# EAGLE schematic BITalino_V3 (EAGLE 6.3)
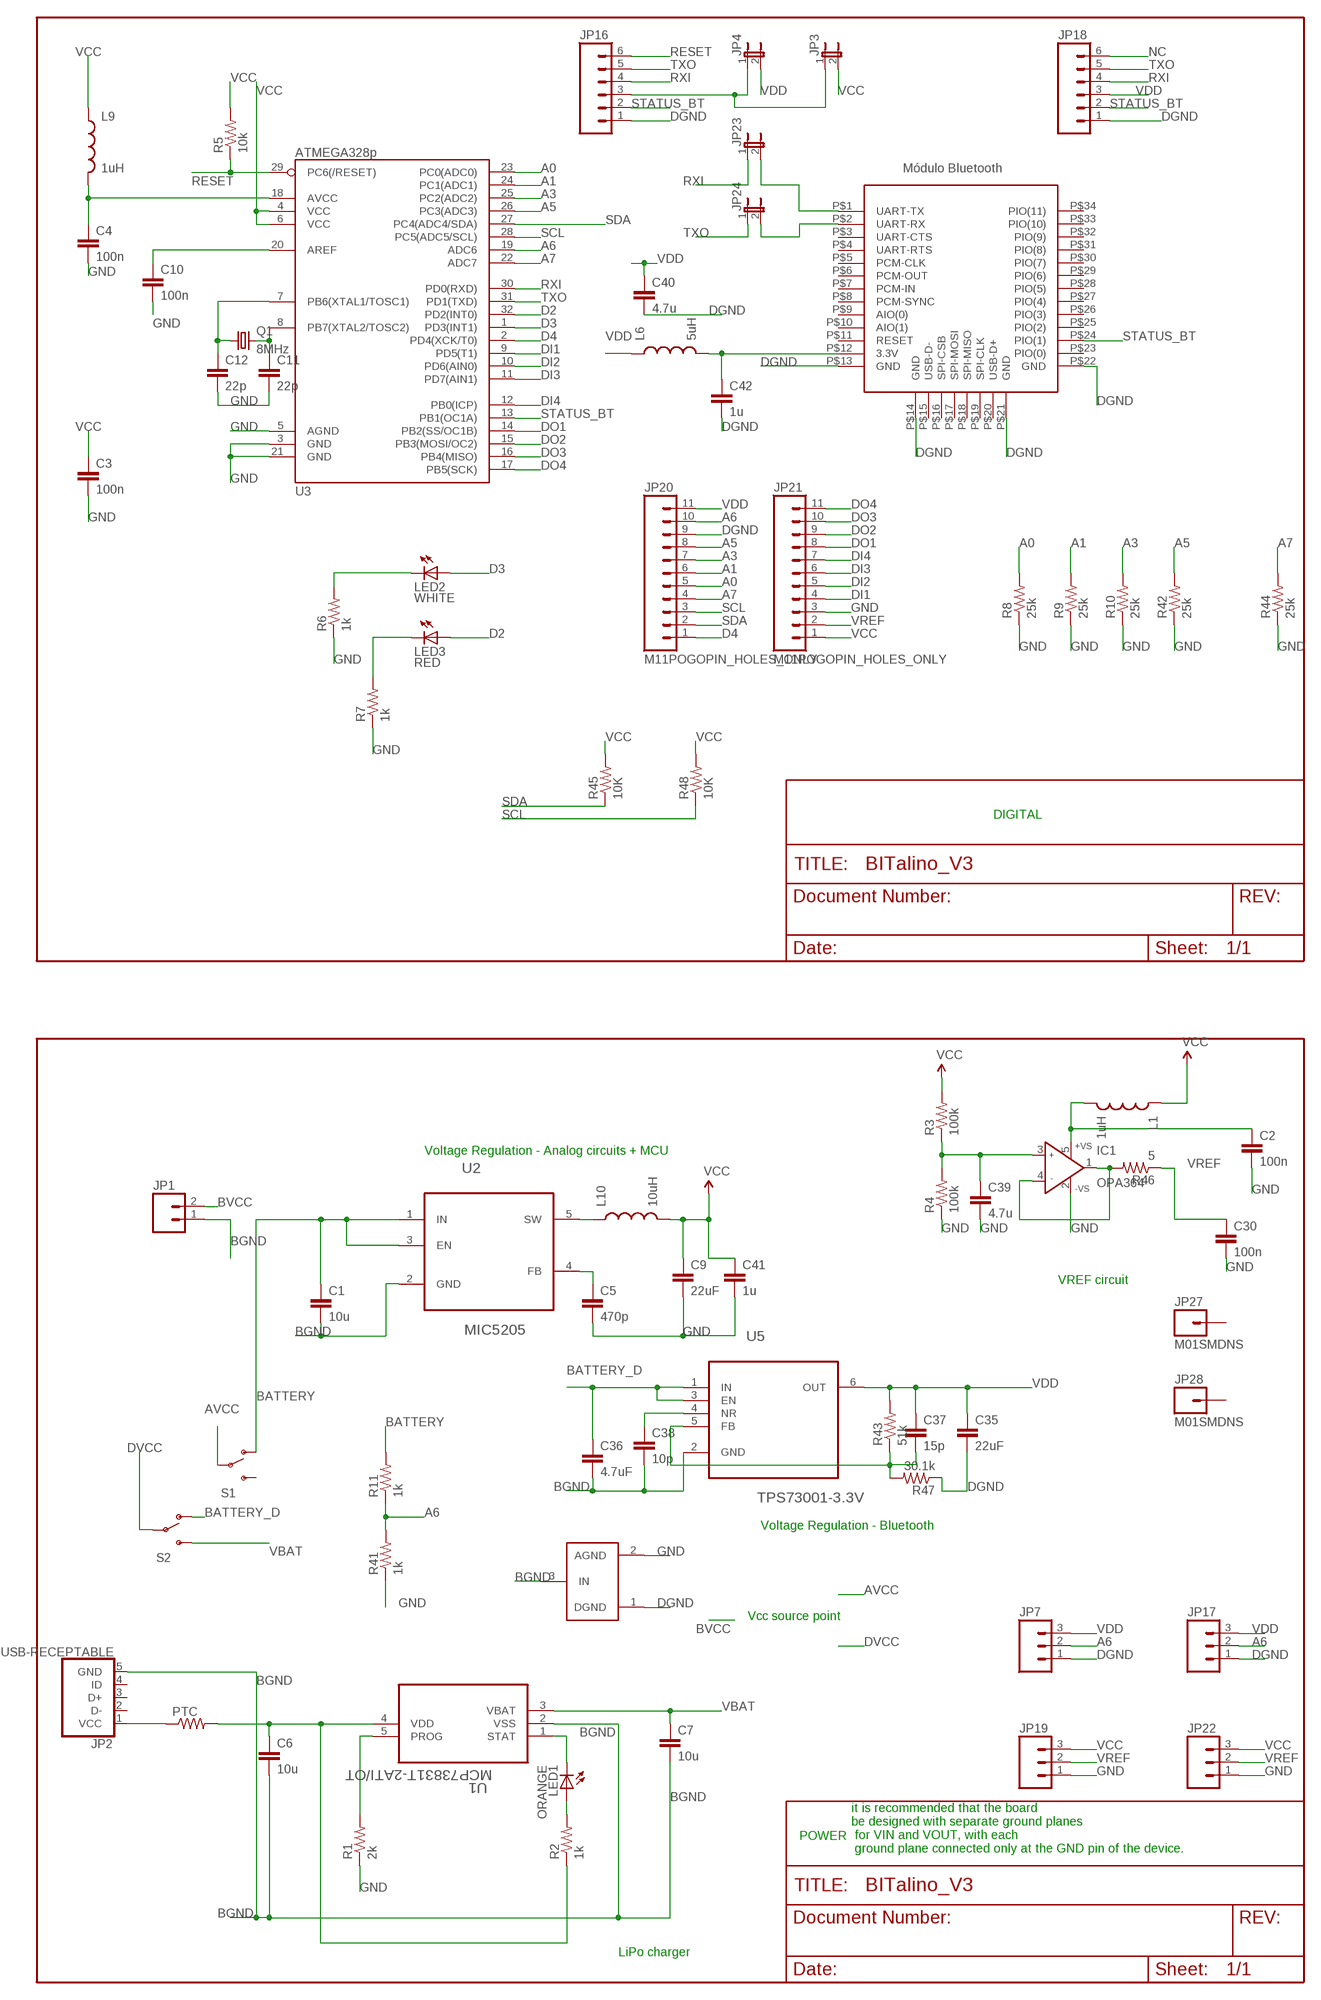
[diagram p0: schematic, sheet 1, part 1 of 3]
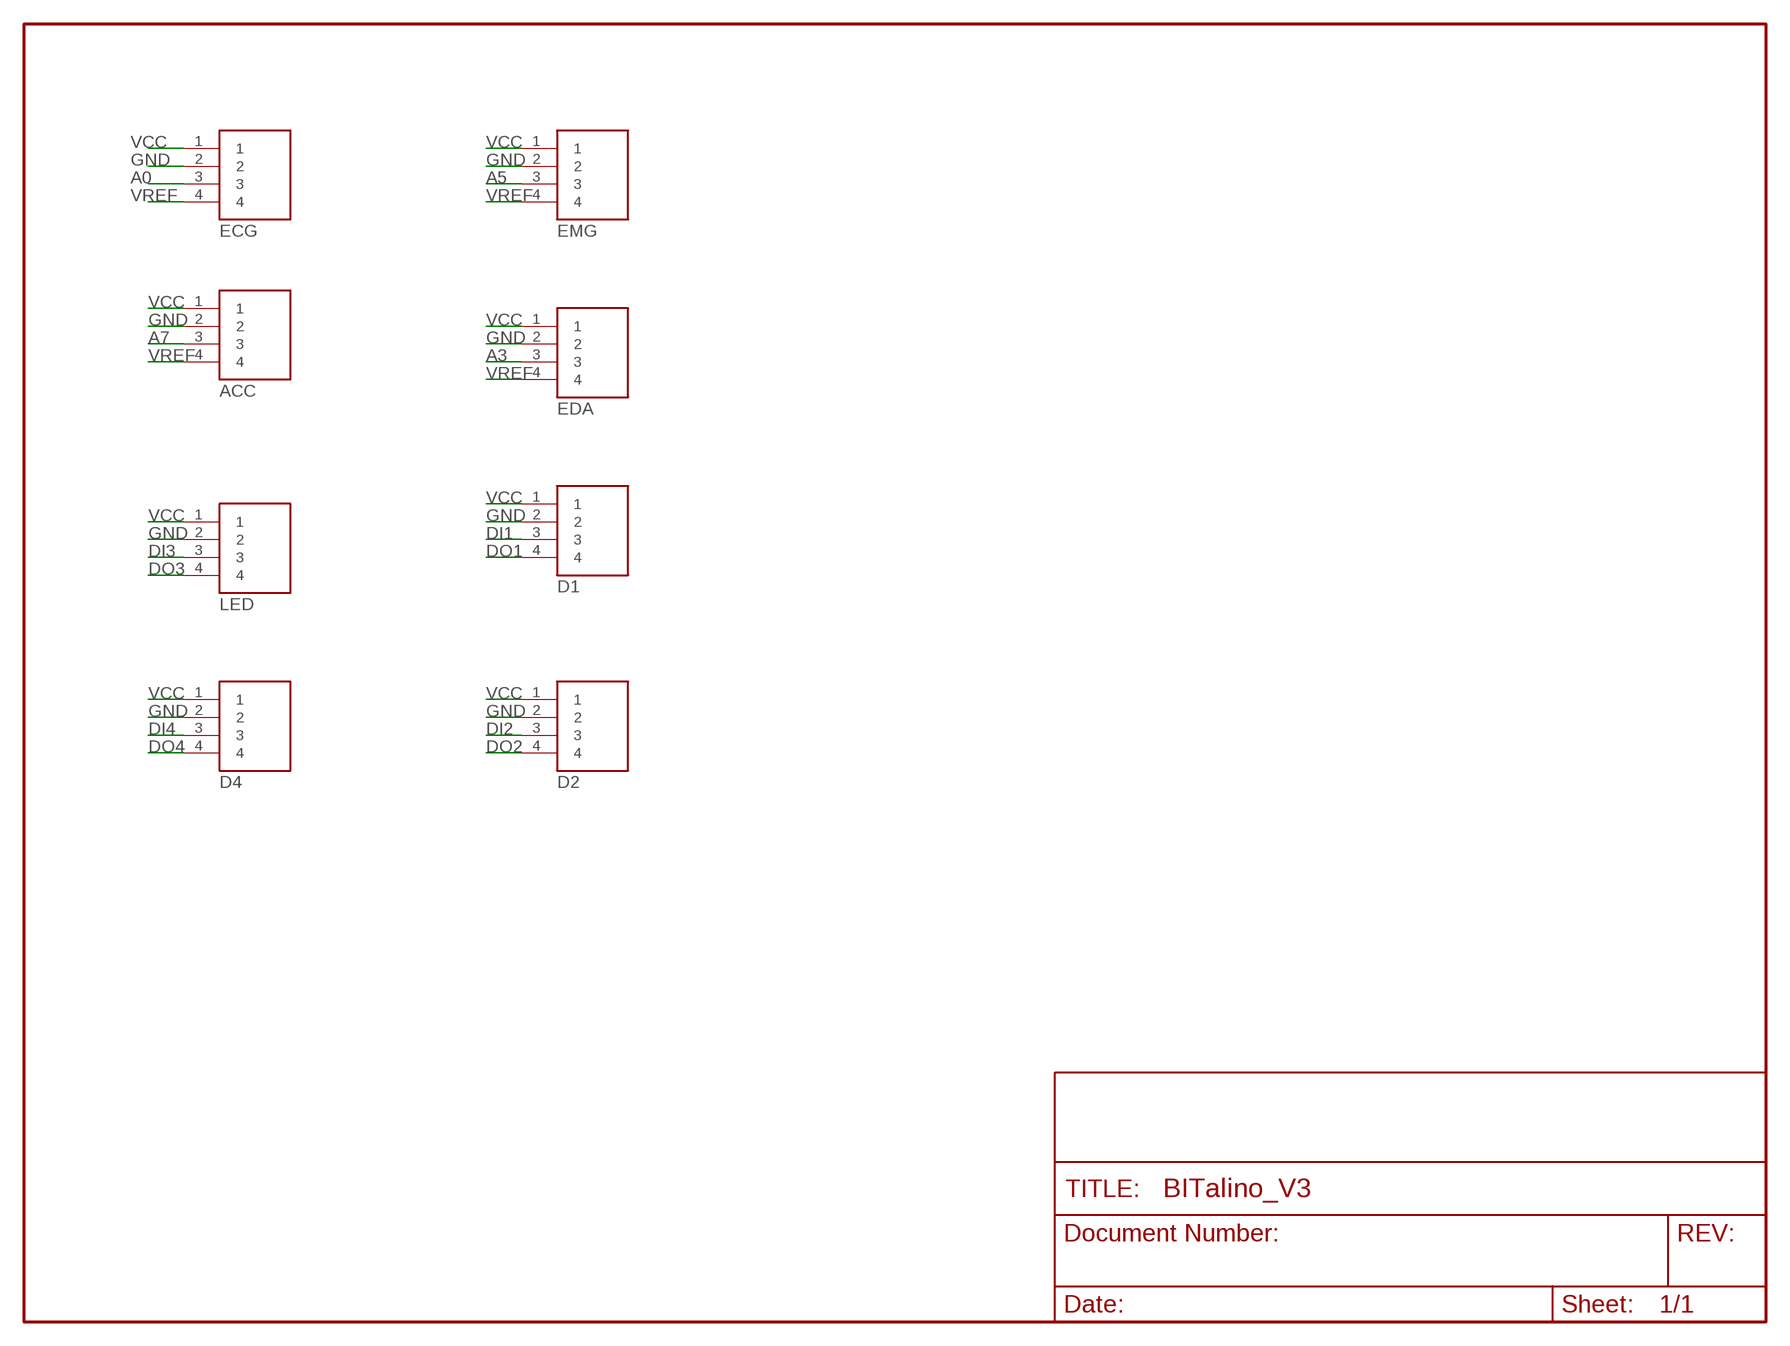
[diagram p1: schematic, sheet 1, part 2 of 3]
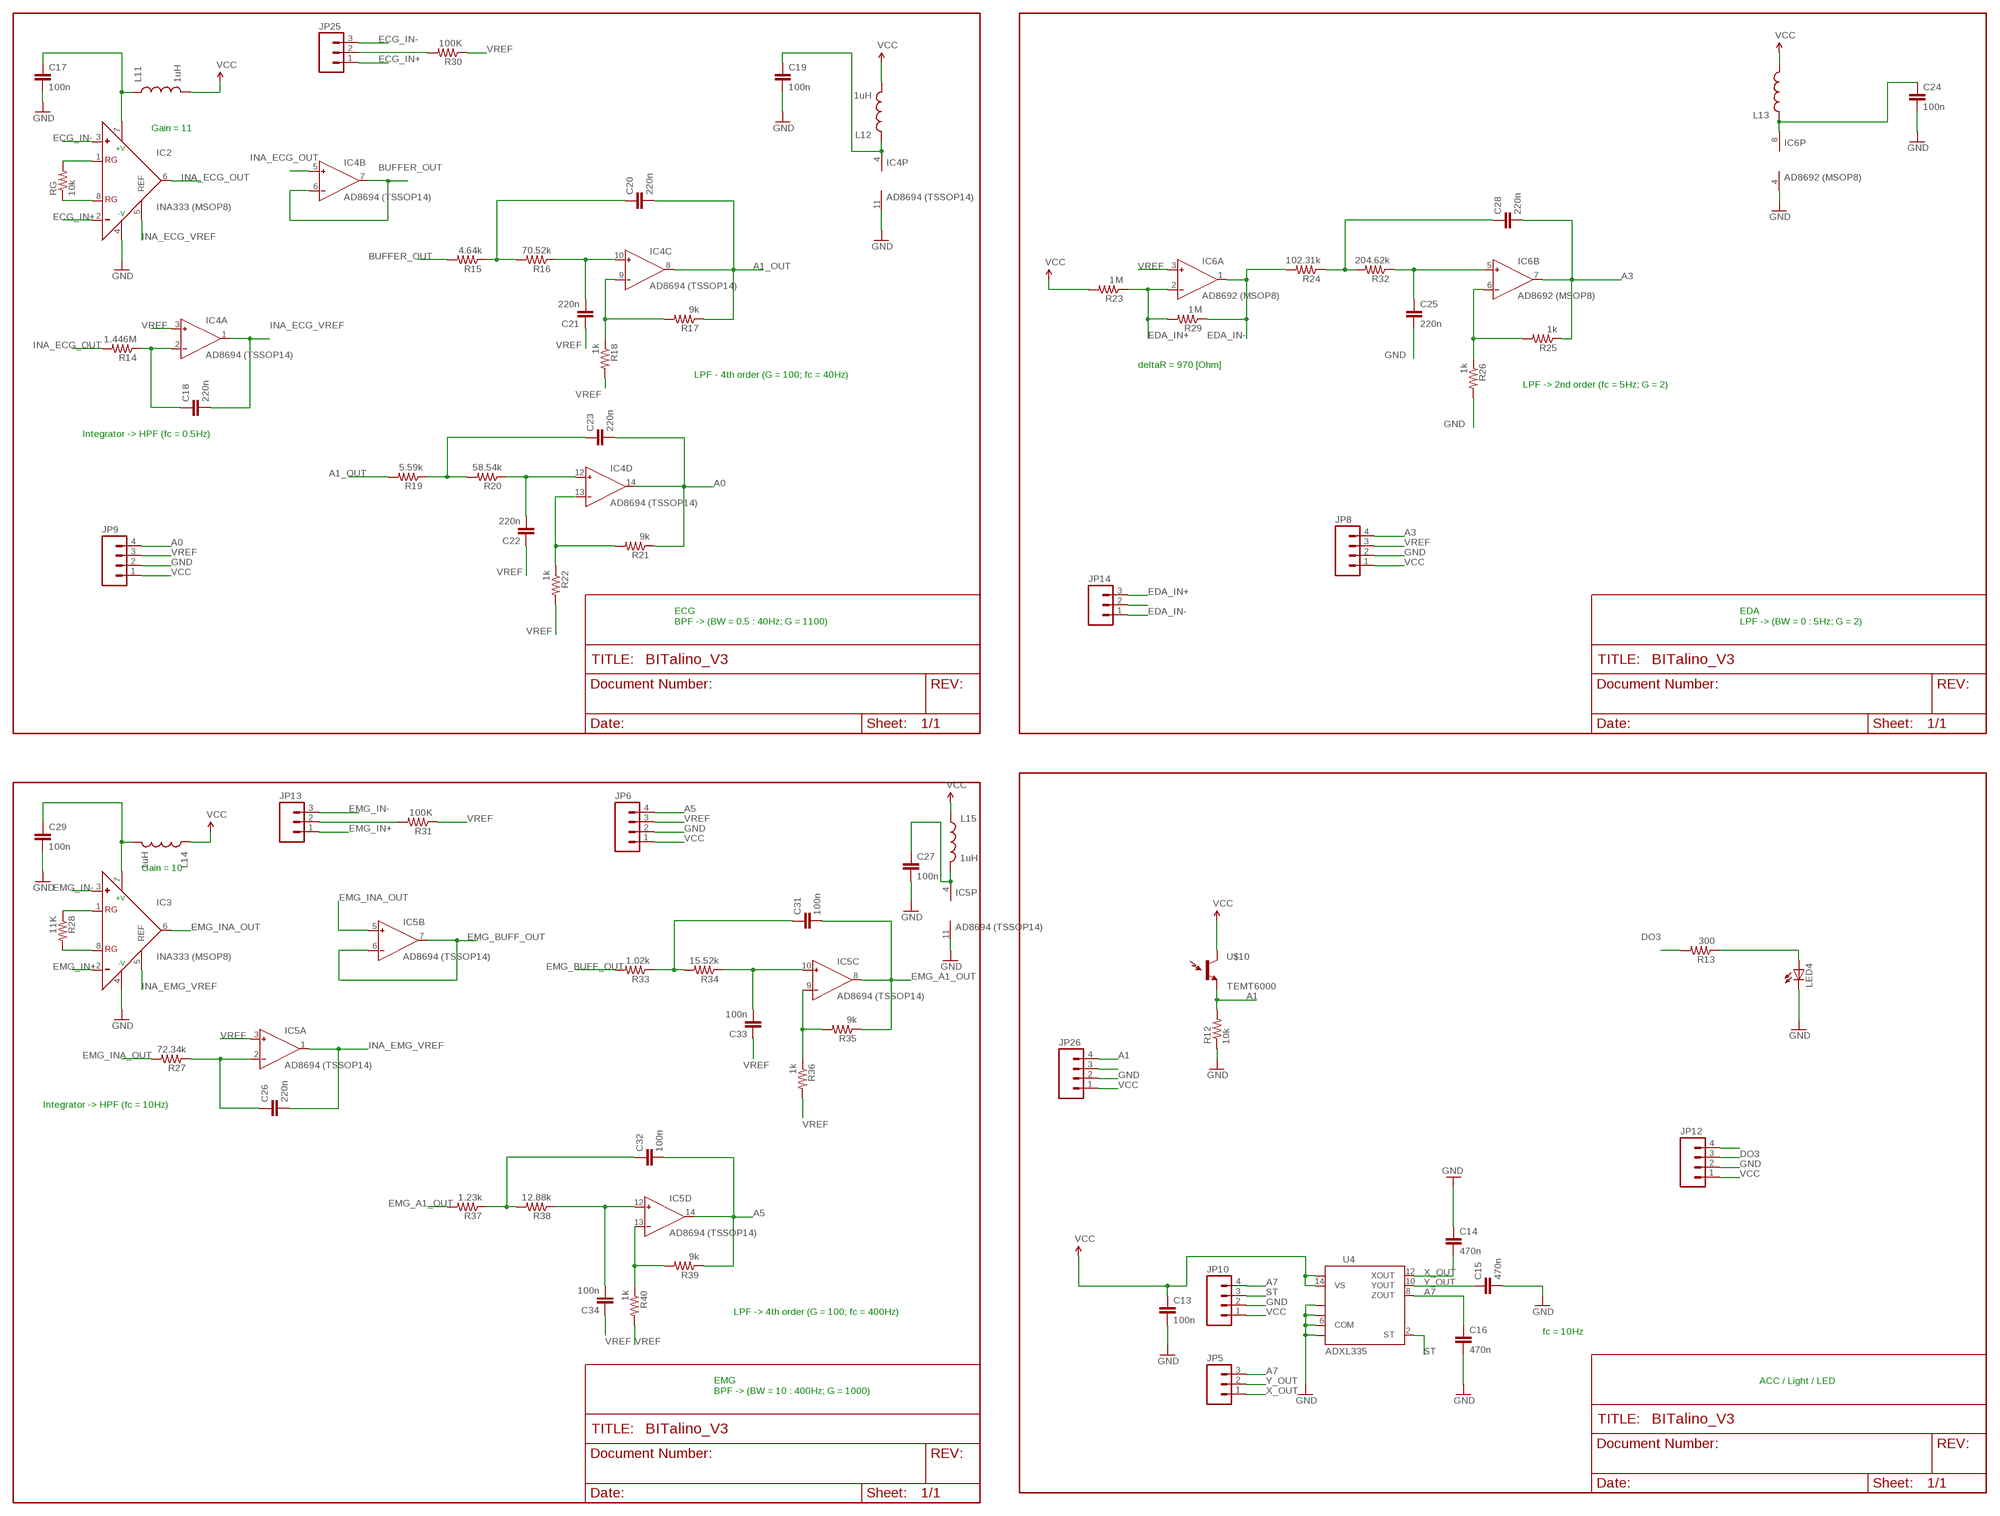
[diagram p2: schematic, sheet 1, part 3 of 3]

## Parts
ACC  RJ22  [SMD]
C1  10u  CAP0805  [0805]
C2  100n  CAP0603-CAP  [0603-CAP]
C3  100n  CAP0603-CAP  [0603-CAP]
C4  100n  CAP0603-CAP  [0603-CAP]
C5  470p  CAP0603-CAP  [0603-CAP]
C6  10u  CAP0805  [0805]
C7  10u  CAP0805  [0805]
C9  22uF  CAP0805  [0805]
C10  100n  CAP0603-CAP  [0603-CAP]
C11  22p  CAP0603-CAP  [0603-CAP]
C12  22p  CAP0603-CAP  [0603-CAP]
C13  100n  CAP0603-CAP  [0603-CAP]
C14  470n  CAP0603-CAP  [0603-CAP]
C15  470n  CAP0603-CAP  [0603-CAP]
C16  470n  CAP0603-CAP  [0603-CAP]
C17  100n  CAP0603-CAP  [0603-CAP]
C18  220n  CAP0603-CAP  [0603-CAP]
C19  100n  CAP0603-CAP  [0603-CAP]
C20  220n  CAP0603-CAP  [0603-CAP]
C21  220n  CAP0603-CAP  [0603-CAP]
C22  220n  CAP0603-CAP  [0603-CAP]
C23  220n  CAP0603-CAP  [0603-CAP]
C24  100n  CAP0603-CAP  [0603-CAP]
C25  220n  CAP0603-CAP  [0603-CAP]
C26  220n  CAP0603-CAP  [0603-CAP]
C27  100n  CAP0603-CAP  [0603-CAP]
C28  220n  CAP0603-CAP  [0603-CAP]
C29  100n  CAP0603-CAP  [0603-CAP]
C30  100n  CAP0603-CAP  [0603-CAP]
C31  100n  CAP0603-CAP  [0603-CAP]
C32  100n  CAP0603-CAP  [0603-CAP]
C33  100n  CAP0603-CAP  [0603-CAP]
C34  100n  CAP0603-CAP  [0603-CAP]
C35  22uF  CAP0805  [0805]
C36  4.7uF  CAP0805  [0805]
C37  15p  CAP0603-CAP  [0603-CAP]
C38  10p  CAP0603-CAP  [0603-CAP]
C39  4.7u  CAP0603-CAP  [0603-CAP]
C40  4.7u  CAP0603-CAP  [0603-CAP]
C41  1u  CAP0603-CAP  [0603-CAP]
C42  1u  CAP0603-CAP  [0603-CAP]
D1  RJ22  [SMD]
D2  RJ22  [SMD]
D4  RJ22  [SMD]
ECG  RJ22  [SMD]
EDA  RJ22  [SMD]
EMG  ECG  RJ22  [SMD]
IC1  OPA364  AD8541RJ  [SOT23-5]
IC2  INA333 (MSOP8)  AD623RM  [MSOP08]
IC3  INA333 (MSOP8)  AD623RM  [MSOP08]
IC4  AD8694 (TSSOP14)  AD8644RU  [TSSOP14]
IC5  AD8694 (TSSOP14)  AD8644RU  [TSSOP14]
IC6  AD8692 (MSOP8)  AD8656RM  [MSOP08]
JP1  M02-JST-2-PTH-NO_SILK  [JST-2-PTH-NS]
JP2  USB-RECEPTABLE  [FCI-10103594-0001LF]
JP3  JUMPER-2SMD-NO-NS  [SJ_2S-NO-NS]
JP4  JUMPER-2SMD-NO-NS  [SJ_2S-NO-NS]
JP5  M03JST-PTH  [JST-3-PTH]
JP6  M04JST-PTH  [JST-4-PTH]
JP7  M031X03_NO_SILK  [1X03_NO_SILK]
JP8  M04JST-PTH  [JST-4-PTH]
JP9  M04JST-PTH  [JST-4-PTH]
JP10  M04JST-PTH  [JST-4-PTH]
JP12  M04JST-PTH  [JST-4-PTH]
JP13  M03JST-PTH  [JST-3-PTH]
JP14  M03JST-PTH  [JST-3-PTH]
JP16  M06POGOPIN_HOLES_ONLY  [1X06_HOLES_ONLY]
JP17  M031X03_NO_SILK  [1X03_NO_SILK]
JP18  M06POGOPIN_HOLES_ONLY  [1X06_HOLES_ONLY]
JP19  M031X03_NO_SILK  [1X03_NO_SILK]
JP20  M11POGOPIN_HOLES_ONLY  [1X11_HOLES_ONLY]
JP21  M11POGOPIN_HOLES_ONLY  [1X11_HOLES_ONLY]
JP22  M031X03_NO_SILK  [1X03_NO_SILK]
JP23  JUMPER-2SMD-NO-NS  [SJ_2S-NO-NS]
JP24  JUMPER-2SMD-NO-NS  [SJ_2S-NO-NS]
JP25  M03JST-PTH  [JST-3-PTH]
JP26  M04JST-PTH  [JST-4-PTH]
JP27  M01SMDNS  [1X01NS]
JP28  M01SMDNS  [1X01NS]
L1  1uH  INDUCTOR0603  [0603]
L6  5uH  INDUCTOR0805  [0805]
L9  1uH  INDUCTOR0603  [0603]
L10  10uH  INDUCTOR0805  [0805]
L11  1uH  INDUCTOR0603  [0603]
L12  1uH  INDUCTOR0603  [0603]
L13  INDUCTOR0603  [0603]
L14  1uH  INDUCTOR0603  [0603]
L15  1uH  INDUCTOR0603  [0603]
LED  RJ22  [SMD]
LED1  ORANGE  LED0603  [LED-0603]
LED2  WHITE  LED0603  [LED-0603]
LED3  RED  LED0603  [LED-0603]
LED4  LED1206  [LED-1206]
PTC  RESISTOR0805-RES  [0805]
Q1  8MHz  CRYSTALCTS406  [CTS406]
R1  2k  RESISTOR0603-RES  [0603-RES]
R2  1k  RESISTOR0603-RES  [0603-RES]
R3  100k  RESISTOR0603-RES  [0603-RES]
R4  100k  RESISTOR0603-RES  [0603-RES]
R5  10k  RESISTOR0603-RES  [0603-RES]
R6  1k  RESISTOR0603-RES  [0603-RES]
R7  1k  RESISTOR0603-RES  [0603-RES]
R8  25k  RESISTOR0603-RES  [0603-RES]
R9  25k  RESISTOR0603-RES  [0603-RES]
R10  25k  RESISTOR0603-RES  [0603-RES]
R11  1k  RESISTOR0603-RES  [0603-RES]
R12  10k  RESISTOR0603-RES  [0603-RES]
R13  300  RESISTOR0603-RES  [0603-RES]
R14  1.446M  RESISTOR0603-RES  [0603-RES]
R15  4.64k  RESISTOR0603-RES  [0603-RES]
R16  70.52k  RESISTOR0603-RES  [0603-RES]
R17  9k  RESISTOR0603-RES  [0603-RES]
R18  1k  RESISTOR0603-RES  [0603-RES]
R19  5.59k  RESISTOR0603-RES  [0603-RES]
R20  58.54k  RESISTOR0603-RES  [0603-RES]
R21  9k  RESISTOR0603-RES  [0603-RES]
R22  1k  RESISTOR0603-RES  [0603-RES]
R23  1M  RESISTOR0603-RES  [0603-RES]
R24  102.31k  RESISTOR0603-RES  [0603-RES]
R25  1k  RESISTOR0603-RES  [0603-RES]
R26  1k  RESISTOR0603-RES  [0603-RES]
R27  72.34k  RESISTOR0603-RES  [0603-RES]
R28  11K  RESISTOR0603-RES  [0603-RES]
R29  1M  RESISTOR0603-RES  [0603-RES]
R30  100K  RESISTOR0603-RES  [0603-RES]
R31  100K  RESISTOR0603-RES  [0603-RES]
R32  204.62k  RESISTOR0603-RES  [0603-RES]
R33  1.02k  RESISTOR0603-RES  [0603-RES]
R34  15.52k  RESISTOR0603-RES  [0603-RES]
R35  9k  RESISTOR0603-RES  [0603-RES]
R36  1k  RESISTOR0603-RES  [0603-RES]
R37  1.23k  RESISTOR0603-RES  [0603-RES]
R38  12.88k  RESISTOR0603-RES  [0603-RES]
R39  9k  RESISTOR0603-RES  [0603-RES]
R40  1k  RESISTOR0603-RES  [0603-RES]
R41  1k  RESISTOR0603-RES  [0603-RES]
R42  25k  RESISTOR0603-RES  [0603-RES]
R43  51k  RESISTOR0603-RES  [0603-RES]
R44  25k  RESISTOR0603-RES  [0603-RES]
R45  10K  RESISTOR0603-RES  [0603-RES]
R46  5  RESISTOR0603-RES  [0603-RES]
R47  30.1k  RESISTOR0603-RES  [0603-RES]
R48  10K  RESISTOR0603-RES  [0603-RES]
RG  10k  RESISTOR0603-RES  [0603-RES]
S1  SWITCH-SPSTPTH  [SWITCH-SPDT]
S2  SWITCH-SPSTPTH  [SWITCH-SPDT]
U1  MCP73831T-2ATI/OT  [SOT95P300X145-5N]
U2  MIC5205  ADP2108AUJZ-3.3-R7  [SOT95P280X130-5N]
U3  ATMEGA328p  ATMEGA168  [TQFP32-08]
U4  ADXL335  [LFCSP-16]
U5  TPS73001-3.3V  TPS73001DBVT  [SOT95P280X145-6N]
U$1  BLUETOOTH  [BLUETOOTH]
U$2  GND_CONNECT  [GND_CONNECT]
U$10  TEMT6000  [TEMT6000-SEN]

## Nets
A0: C23.2 ECG.3 IC4.14(D:OUT) JP9.4 JP20.5 R8.2 R21.1 U3.23(PC0(ADC0))
A1: JP20.6 JP26.4 R9.2 R12.2 U3.24(PC1(ADC1)) U$10.EMITTER(E1)
A1_OUT: C20.2 IC4.8(C:OUT) R17.1 R19.2
A3: C28.2 EDA.3 IC6.7(B:OUT) JP8.4 JP20.7 R10.2 R25.1 U3.25(PC2(ADC2))
A5: C32.2 EMG.3 IC5.14(D:OUT) JP6.4 JP20.8 R39.1 R42.2 U3.26(PC3(ADC3))
A6: JP7.2 JP17.2 JP20.10 R11.1 R41.2 U3.19(ADC6)
A7: ACC.3 C16.1 JP5.3 JP10.4 JP20.4 R44.2 U3.22(ADC7) U4.8(ZOUT)
AVCC: S1.2(P)
BATTERY: C1.1 R11.2 S1.1(O) U2.1(IN) U2.3(EN)
BATTERY_D: C36.1 S2.1(O) U5.1(IN) U5.3(EN)
BGND: C1.2 C6.2 C7.2 C36.2 C38.2 JP1.1 JP2.5(GND) U1.2(VSS) U2.2(GND) U5.2(GND) U$2.3(IN)
BUFFER_OUT: IC4.6(B:IN-) IC4.7(B:OUT) R15.2
BVCC: JP1.2
D2: LED3.A U3.32(PD2(INT0))
D3: LED2.A U3.1(PD3(INT1))
D4: JP20.1 U3.2(PD4(XCK/T0))
DGND: C35.2 C40.2 C42.2 JP7.1 JP16.1 JP17.1 JP18.1 JP20.9 R47.1 U$1.P$13(GND) U$1.P$14(GND) U$1.P$21(GND) U$1.P$22(GND) U$2.1(DGND)
DI1: D1.3 JP21.4 U3.9(PD5(T1))
DI2: D2.3 JP21.5 U3.10(PD6(AIN0))
DI3: JP21.6 LED.3 U3.11(PD7(AIN1))
DI4: D4.3 JP21.7 U3.12(PB0(ICP))
DO1: D1.4 JP21.8 U3.14(PB2(SS/OC1B))
DO2: D2.4 JP21.9 U3.15(PB3(MOSI/OC2))
DO3: JP12.3 JP21.10 LED.4 R13.2 U3.16(PB4(MISO))
DO4: D4.4 JP21.11 U3.17(PB5(SCK))
DVCC: S2.2(P)
ECG_IN+: IC2.2(-) JP25.1
ECG_IN-: IC2.3(+) JP25.3
EDA_IN+: IC6.2(A:IN-) JP14.3 R23.1 R29.2
EDA_IN-: IC6.1(A:OUT) JP14.1 R24.2 R29.1
EMG_A1_OUT: C31.2 IC5.8(C:OUT) R35.1 R37.2
EMG_BUFF_OUT: IC5.6(B:IN-) IC5.7(B:OUT) R33.2
EMG_IN+: IC3.2(-) JP13.1
EMG_IN-: IC3.3(+) JP13.3
EMG_INA_OUT: IC3.6(OUT) IC5.5(B:IN+) R27.2
GND: ACC.2 C2.2 C3.2 C4.2 C5.2 C9.2 C10.2 C11.2 C12.2 C13.2 C14.1 C15.2 C16.2 C17.2 C19.2 C24.2 C25.2 C27.2 C29.2 C30.2 C39.2 C41.2 D1.2 D2.2 D4.2 ECG.2 EDA.2 EMG.2 IC1.2(-VS) IC2.4(-V) IC3.4(-V) IC4.11(P:V-) IC5.11(P:V-) IC6.4(P:V-) JP6.2 JP8.2 JP9.2 JP10.2 JP12.2 JP19.1 JP21.3 JP22.1 JP26.2 LED4.C LED.2 R1.1 R4.1 R6.1 R7.1 R8.1 R9.1 R10.1 R12.1 R26.2 R41.1 R42.1 R44.1 U3.3(GND) U3.5(AGND) U3.21(GND) U4.3(COM) U4.5(COM) U4.6(COM) U4.7(COM) U$2.2(AGND)
INA_ECG_OUT: IC2.6(OUT) IC4.5(B:IN+) R14.2
INA_ECG_VREF: C18.2 IC2.5(REF) IC4.1(A:OUT)
INA_EMG_VREF: C26.2 IC3.5(REF) IC5.1(A:OUT)
N$1: C6.1 PTC.2 R2.1 U1.4(VDD)
N$2: R1.2 U1.5(PROG)
N$3: LED1.A R2.2
N$4: LED1.C U1.1(STAT)
N$5: L10.1 U2.5(SW)
N$6: C39.1 IC1.3(IN+) R3.1 R4.2
N$7: C38.1 U5.4(NR)
N$8: C10.1 U3.20(AREF)
N$10: C12.1 Q1.1 U3.7(PB6(XTAL1/TOSC1))
N$11: C11.1 Q1.3 U3.8(PB7(XTAL2/TOSC2))
N$12: LED2.C R6.2
N$13: JP23.2 U$1.P$1(UART-TX)
N$14: JP24.2 U$1.P$2(UART-RX)
N$15: LED3.C R7.2
N$16: C4.1 L9.2 U3.18(AVCC)
N$17: C5.1 U2.4(FB)
N$19: IC3.1(RG) R28.1
N$20: IC3.8(RG) R28.2
N$21: JP14.2
N$22: JP3.1 JP4.1 JP16.3
N$23: C29.1 IC3.7(+V) L14.2
N$24: C17.1 IC2.7(+V) L11.1
N$25: C27.1 IC5.4(P:V+) L15.2
N$26: JP2.1(VCC) PTC.1
N$27: LED4.A R13.1
N$28: IC2.1(RG) RG.2
N$29: IC2.8(RG) RG.1
N$30: C18.1 IC4.2(A:IN-) R14.1
N$31: C21.2 IC4.10(C:IN+) R16.1
N$32: C20.1 R15.1 R16.2
N$33: JP26.3
N$34: IC4.9(C:IN-) R17.2 R18.1
N$35: C37.2 R43.1 R47.2 U5.5(FB)
N$36: C19.1 IC4.4(P:V+) L12.1
N$37: C28.1 R24.1 R32.2
N$38: C22.2 IC4.12(D:IN+) R20.1
N$39: C23.1 R19.1 R20.2
N$40: C25.1 IC6.5(B:IN+) R32.1
N$41: IC4.13(D:IN-) R21.2 R22.1
N$42: IC6.6(B:IN-) R25.2 R26.1
N$43: JP25.2 R30.2
N$44: C2.1 IC1.5(+VS) L1.2
N$45: JP13.2 R31.2
N$46: C24.1 IC6.8(P:V+) L13.1
N$48: JP12.4
N$50: C42.1 L6.2 U$1.P$12(3.3V)
N$51: IC1.1(OUT) IC1.4(IN-) R46.2
N$55: C26.1 IC5.2(A:IN-) R27.1
N$57: C33.2 IC5.10(C:IN+) R34.1
N$59: C31.1 R33.1 R34.2
N$65: IC5.9(C:IN-) R35.2 R36.1
N$66: C34.2 IC5.12(D:IN+) R38.1
N$67: C32.1 R37.1 R38.2
N$70: IC5.13(D:IN-) R39.2 R40.1
NC: JP18.6
RESET: JP16.6 R5.1 U3.29(PC6(/RESET))
RXI: JP16.4 JP18.4 JP23.1 U3.30(PD0(RXD))
SCL: JP20.3 R48.1 U3.28(PC5(ADC5/SCL))
SDA: JP20.2 R45.1 U3.27(PC4(ADC4/SDA))
ST: JP10.3 U4.2(ST)
STATUS_BT: JP16.2 JP18.2 U3.13(PB1(OC1A)) U$1.P$24(PIO(1))
TXO: JP16.5 JP18.5 JP24.1 U3.31(PD1(TXD))
VBAT: C7.1 S2.3(S) U1.3(VBAT)
VCC: ACC.1 C3.1 C9.1 C13.1 C41.1 D1.1 D2.1 D4.1 ECG.1 EDA.1 EMG.1 JP3.2 JP6.1 JP8.1 JP9.1 JP10.1 JP12.1 JP19.3 JP21.1 JP22.3 JP26.1 L1.1 L9.1 L10.2 L11.2 L12.2 L13.2 L14.1 L15.1 LED.1 R3.2 R5.2 R23.2 R45.2 R48.2 U3.4(VCC) U3.6(VCC) U4.14(VS) U4.15(VS) U$10.COLLECTOR(C1)
VDD: C35.1 C37.1 C40.1 JP4.2 JP7.3 JP17.3 JP18.3 JP20.11 L6.1 R43.2 U5.6(OUT)
VREF: ACC.4 C21.1 C22.1 C30.1 C33.1 C34.1 ECG.4 EDA.4 EMG.4 IC4.3(A:IN+) IC5.3(A:IN+) IC6.3(A:IN+) JP6.3 JP8.3 JP9.3 JP19.2 JP21.2 JP22.2 R18.2 R22.2 R30.1 R31.1 R36.2 R40.2 R46.1
X_OUT: C14.2 JP5.1 U4.12(XOUT)
Y_OUT: C15.1 JP5.2 U4.10(YOUT)
Unconnected: JP2.2(D-) JP2.3(D+) JP2.4(ID) JP27.1 JP28.1 S1.3(S) U$1.P$3(UART-CTS) U$1.P$4(UART-RTS) U$1.P$5(PCM-CLK) U$1.P$6(PCM-OUT) U$1.P$7(PCM-IN) U$1.P$8(PCM-SYNC) U$1.P$9(AIO(0)) U$1.P$10(AIO(1)) U$1.P$11(RESET) U$1.P$15(USB-D-) U$1.P$16(SPI-CSB) U$1.P$17(SPI-MOSI) U$1.P$18(SPI-MISO) U$1.P$19(SPI-CLK) U$1.P$20(USB-D+) U$1.P$23(PIO(0)) U$1.P$25(PIO(2)) U$1.P$26(PIO(3)) U$1.P$27(PIO(4)) U$1.P$28(PIO(5)) U$1.P$29(PIO(6)) U$1.P$30(PIO(7)) U$1.P$31(PIO(8)) U$1.P$32(PIO(9)) U$1.P$33(PIO(10)) U$1.P$34(PIO(11))

## Notes on the sheet
- Gain = 11
- deltaR = 970 [Ohm]
- LPF - 4th order (G = 100; fc = 40Hz)
- LPF -> 2nd order (fc = 5Hz; G = 2)
- Integrator -> HPF (fc = 0.5Hz)
- DIGITAL
- ECG
  BPF -> (BW = 0.5 : 40Hz; G = 1100)
- EDA
  LPF -> (BW = 0 : 5Hz; G = 2)
- Gain = 10
- Voltage Regulation - Analog circuits + MCU
- VREF circuit
- Integrator -> HPF (fc = 10Hz)
- Voltage Regulation - Bluetooth
- Vcc source point
- LPF -> 4th order (G = 100; fc = 400Hz)
- fc = 10Hz
- ACC / Light / LED
- EMG
  BPF -> (BW = 10 : 400Hz; G = 1000)
- POWER
- it is recommended that the board 
  be designed with separate ground planes
   for VIN and VOUT, with each
   ground plane connected only at the GND pin of the device.
- LiPo charger

## Library data of the parts
ACC D1 D2 D4 ECG EDA EMG LED = rj22:RJ22
C1-C7 C9-C42 = SparkFun:CAP: Capacitor Standard 0603 ceramic capacitor, and 0.1" leaded capacitor.
IC1 = analog-devices:AD8541: General-Purpose CMOS Rail-to-Rail Amplifiers Source: http://www.analog.com/static/imported-files/data_sheets/AD8541_8542_8544.pdf; MF: ALTERA CORPORATION; MPN: AD8541ARTZ-REEL7; OC_FARNELL: 1464963; OC_NEWARK: 88H0268
IC2 IC3 = analog-devices:AD623: Single-Supply, Rail-to-Rail, Low Cost Instrumentation Amplifier Source: http://www.analog.com/static/imported-files/data_sheets/AD623.pdf; MPN: AD623ARMZ; OC_FARNELL: 1660961; OC_NEWARK: 19M8824
IC4 IC5 = analog-devices:AD8644: Single and Quad 18 V Operational Amplifiers Source: http://www.analog.com/static/imported-files/data_sheets/AD8614_8644.pdf; MF: ALTERA CORPORATION; MPN: AD8644ARUZ; OC_FARNELL: 1438873; OC_NEWARK: 59K7036
IC6 = analog-devices:AD8656: Low Noise, Precision CMOS Amplifier Source: http://www.analog.com/static/imported-files/data_sheets/AD8655_8656.pdf; MPN: AD8656ARMZ; OC_FARNELL: 1117887; OC_NEWARK: 34P3252
JP1 = SparkFun:M02: Header 2 Standard 2-pin 0.1" header. Use with straight break away headers (SKU : PRT-00116), right angle break away headers (PRT-00553), swiss pins (PRT-00743), machine pins (PRT-00117), and female headers (PRT-00115). Molex polarized connector foot print use with SKU : PRT-08233 with associated crimp pins and housings.
JP2 = micro_USB:USB-RECEPTABLE: USB Receptable
JP3 JP4 JP23 JP24 = SparkFun:JUMPER-2: Jumper Basic 0.1" spaced jumper. Use with breakaway headers.
JP5 JP7 JP13 JP14 JP17 JP19 JP22 JP25 = SparkFun:M03: Header 3 Standard 3-pin 0.1" header. Use with straight break away headers (SKU : PRT-00116), right angle break away headers (PRT-00553), swiss pins (PRT-00743), machine pins (PRT-00117), and female headers (PRT-00115). Molex polarized connector foot print use with SKU : PRT-08232 with associated crimp pins and housings.
JP6 JP8-JP10 JP12 JP26 = SparkFun:M04: Header 4 Standard 4-pin 0.1" header. Use with straight break away headers (SKU : PRT-00116), right angle break away headers (PRT-00553), swiss pins (PRT-00743), machine pins (PRT-00117), and female headers (PRT-00115). Molex polarized connector foot print use with SKU : PRT-08231 with associated crimp pins and housings. 1MM SMD Version SKU: PRT-10208
JP16 JP18 = SparkFun:M06: Header 6 Standard 6-pin 0.1" header. Use with straight break away headers (SKU : PRT-00116), right angle break away headers (PRT-00553), swiss pins (PRT-00743), machine pins (PRT-00117), and female headers (PRT-00115). Molex polarized connector foot print use with SKU : PRT-08094 with associated crimp pins and housings. NOTES ON THE VARIANTS LOCK and LOCK_LONGPADS... This footprint was designed to help hold the alignment of a through-hole component (i.e. 6-pin header) while soldering it into place. You may notice that each hole has been shifted either up or down by 0.005 of an inch from it's more standard position (which is a perfectly straight line). This slight alteration caused the pins (the squares in the middle) to touch the edges of the holes. Because they are alternating, it causes a "brace" to hold the component in place. 0.005 has proven to be the perfect amount of "off-center" position when using our standard breakaway headers. Although looks a little odd when you look at the bare footprint, once you have a header in there, the alteration is very hard to notice. Also, if you push a header all the way into place, it is covered up entirely on the bottom side. This idea of altering the position of holes to aid alignment will be further integrated into the Sparkfun Library for other footprints. It can help hold any component with 3 or more connection pins.
JP20 JP21 = SparkFun:M11: Header 11 Standard 11-pin 0.1" header. Use with straight break away headers (SKU : PRT-00116), right angle break away headers (PRT-00553), swiss pins (PRT-00743), machine pins (PRT-00117), and female headers (PRT-00115).
JP27 JP28 = SparkFun:M01: Header 1 Standard 1-pin 0.1" header. Use with straight break away headers (SKU : PRT-00116), right angle break away headers (PRT-00553), swiss pins (PRT-00743), machine pins (PRT-00117), and female headers (PRT-00115).
L1 L6 L9-L15 = SparkFun:INDUCTOR: Inductors Basic Inductor/Choke - 0603 and 1206. Footprints are not proven and vary greatly between part numbers.
LED1-LED4 = SparkFun:LED: LEDs Standard schematic elements and footprints for 5mm, 3mm, 1206, and 0603 sized LEDs. 5mm - Spark Fun Electronics SKU : COM-00529 (and others)
PTC R1-R48 RG = SparkFun:RESISTOR: Resistor Basic schematic elements and footprints for 0603, 1206, and PTH resistors.
Q1 = crystal:CRYSTAL: CRYSTAL; OC_FARNELL: unknown; OC_NEWARK: unknown
S1 S2 = SparkFun:SWITCH-SPST: SPST Switch Simple slide switch. Spark Fun Electronics SKU : COM-00102
U1 = Microship_BAT_CHARGER_MCP73831T:MCP73831T-2ATI/OT: IC, BATT CHARGER, Li-Ion Li-Polymer, 500 mA; MPN: MCP73831T-2ATI/OT; OC_FARNELL: 1834890; OC_NEWARK: 84R5196; PACKAGE: SOT23-5; SUPPLIER: Microchip
U2 = ADP2108AUJZ-3.3-R7:ADP2108AUJZ-3.3-R7: Compact, 600 mA, 3 MHz, Step-Down DC-to-DC Converter; MPN: ADP2108AUJZ-3.3-R7; OC_FARNELL: 2112606; PACKAGE: TSOT; SUPPLIER: ANALOG DEVICES
U3 = SparkFun:ATMEGA168
U4 = SparkFun:ADXL335
U5 = TI-TPS73001-LDO-ADJ:TPS73001DBVT: Low Dropout Linear Regulators; MPN: TPS73001DBVT; OC_FARNELL: 1135389; OC_NEWARK: 71J8225; PACKAGE: SOT-23-6; SUPPLIER: Texas Instruments
U$1 = bluetooth:BLUETOOTH
U$2 = SparkFun:GND_CONNECT
U$10 = SparkFun:TEMT6000: Ambient Light Sensor Simple light detection sensor. Output varies with light intensity input. Spark Fun Electronics SKU : COM-08348